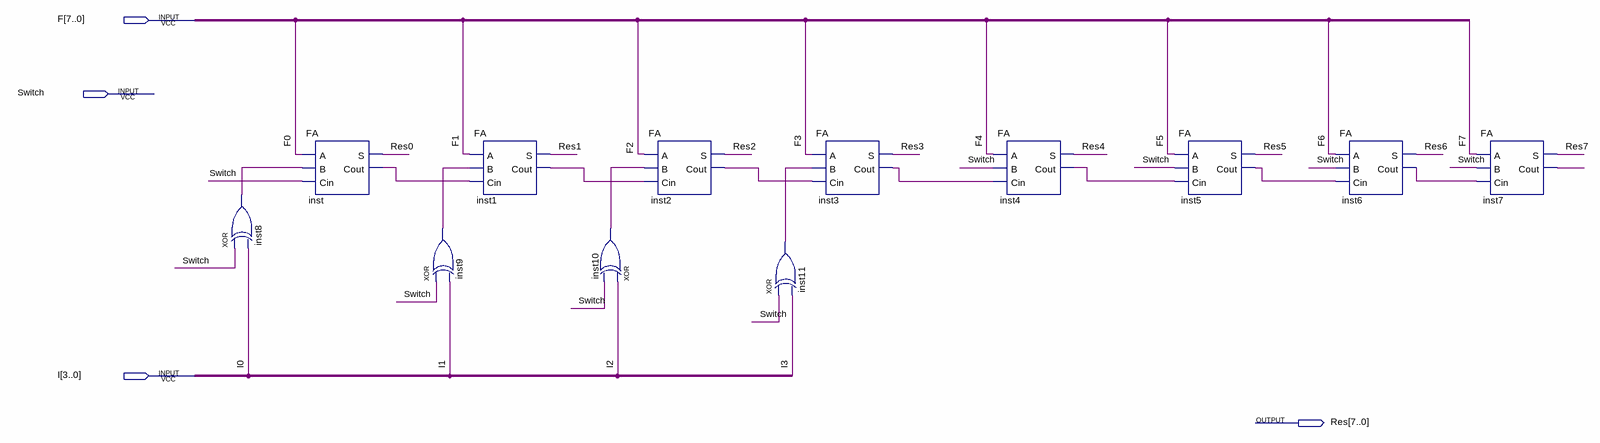
[diagram p0: schematic sheet]
// Quartus schematic 8bitAdder.bdf as structural Verilog: 12 symbols, 4 pins
module \8bitAdder  (
  input  [7:0] F,
  input  Switch,
  input  [3:0] I,
  output [7:0] Res
);

  wire inst1_cout, inst2_cout, inst3_cout, inst4_cout, inst5_cout, inst6_cout, inst7_cout, inst8_out,
       inst9_out, inst10_out, inst11_out, inst_cout;

  xor inst8 (inst8_out, Switch, I[0]);
  FA inst (.A(F[0]), .B(inst8_out), .Cin(Switch), .S(Res[0]), .Cout(inst_cout));
  FA inst1 (.A(F[1]), .B(inst9_out), .Cin(inst_cout), .S(Res[1]), .Cout(inst1_cout));
  xor inst9 (inst9_out, Switch, I[1]);
  xor inst10 (inst10_out, I[2], Switch);
  FA inst2 (.A(F[2]), .B(inst10_out), .Cin(inst1_cout), .S(Res[2]), .Cout(inst2_cout));
  xor inst11 (inst11_out, Switch, I[3]);
  FA inst3 (.A(F[3]), .B(inst11_out), .Cin(inst2_cout), .S(Res[3]), .Cout(inst3_cout));
  FA inst4 (.A(F[4]), .B(Switch), .Cin(inst3_cout), .S(Res[4]), .Cout(inst4_cout));
  FA inst5 (.A(F[5]), .B(Switch), .Cin(inst4_cout), .S(Res[5]), .Cout(inst5_cout));
  FA inst6 (.A(F[6]), .B(Switch), .Cin(inst5_cout), .S(Res[6]), .Cout(inst6_cout));
  FA inst7 (.A(F[7]), .B(Switch), .Cin(inst6_cout), .S(Res[7]), .Cout(inst7_cout));
endmodule
